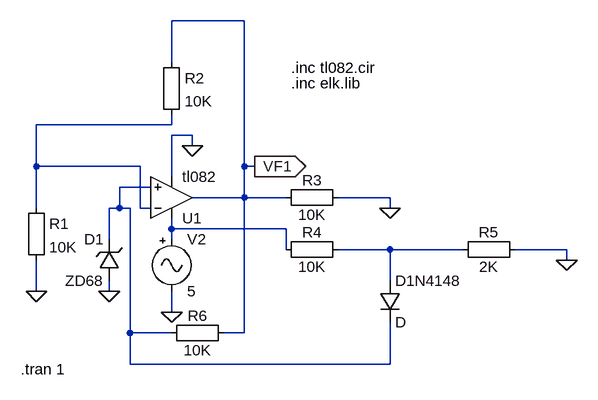
[diagram p0: schematic 10_2_TW_getauscht.asc]
10_2_TW_getauscht.asc, the LTspice schematic file:
Version 4
SHEET 1 1112 680
WIRE 240 -16 128 -16
WIRE 128 48 128 -16
WIRE 128 144 128 128
WIRE 128 144 -80 144
WIRE 160 160 128 160
WIRE 160 176 160 160
WIRE -80 208 -80 144
WIRE 80 208 -80 208
WIRE 240 208 240 -16
WIRE 256 208 240 208
WIRE 128 224 128 160
WIRE 96 240 48 240
WIRE 240 256 240 208
WIRE 240 256 160 256
WIRE 304 256 240 256
WIRE 464 256 384 256
WIRE -80 272 -80 208
WIRE 48 272 48 240
WIRE 48 272 32 272
WIRE 64 272 48 272
WIRE 80 272 80 208
WIRE 96 272 80 272
WIRE 464 272 464 256
WIRE 128 304 128 288
WIRE 304 304 128 304
WIRE 32 320 32 272
WIRE 128 320 128 304
WIRE 304 336 304 304
WIRE 464 336 384 336
WIRE 576 336 464 336
WIRE 736 336 656 336
WIRE 736 352 736 336
WIRE 464 384 464 336
WIRE -80 400 -80 352
WIRE 32 400 32 384
WIRE 128 432 128 400
WIRE 64 464 64 272
WIRE 128 464 64 464
WIRE 240 464 240 256
WIRE 240 464 208 464
WIRE 64 512 64 464
WIRE 464 512 464 448
WIRE 464 512 64 512
FLAG 128 432 0
FLAG -80 400 0
FLAG 160 176 0
FLAG 464 272 0
FLAG 736 352 0
FLAG 32 400 0
FLAG 256 208 VF1
IOPIN 256 208 Out
SYMBOL Misc\\EuropeanResistor -96 256 R0
SYMATTR InstName R1
SYMATTR Value 10K
SYMATTR SpiceLine tol=1 pwr=0.1
SYMBOL zener 48 384 R180
WINDOW 0 24 64 Left 2
WINDOW 3 24 0 Left 2
SYMATTR InstName D1
SYMATTR Value ZD68
SYMBOL Opamps\\opamp2 128 320 M180
SYMATTR InstName U1
SYMATTR Value tl082
SYMBOL Misc\\EuropeanResistor 112 32 R0
SYMATTR InstName R2
SYMATTR Value 10K
SYMATTR SpiceLine tol=1 pwr=0.1
SYMBOL Misc\\EuropeanResistor 400 240 R90
WINDOW 0 5 56 VBottom 2
WINDOW 3 27 56 VTop 2
SYMATTR InstName R3
SYMATTR Value 10K
SYMATTR SpiceLine tol=1 pwr=0.1
SYMBOL Misc\\EuropeanResistor 400 320 R90
WINDOW 0 5 56 VBottom 2
WINDOW 3 27 56 VTop 2
SYMATTR InstName R4
SYMATTR Value 10K
SYMATTR SpiceLine tol=1 pwr=0.1
SYMBOL Misc\\EuropeanResistor 672 320 R90
WINDOW 0 5 56 VBottom 2
WINDOW 3 27 56 VTop 2
SYMATTR InstName R5
SYMATTR Value 2K
SYMBOL diode 448 384 R0
SYMATTR InstName D1N4148
SYMBOL Misc\\EuropeanResistor 224 448 R90
WINDOW 0 5 56 VBottom 2
WINDOW 3 27 56 VTop 2
SYMATTR InstName R6
SYMATTR Value 10K
SYMATTR SpiceLine tol=1 pwr=0.1
SYMBOL Misc\\signal 128 304 R0
WINDOW 123 0 0 Left 0
WINDOW 39 0 0 Left 0
SYMATTR InstName V2
SYMATTR Value 5
TEXT 312 56 Left 2 !.inc tl082.cir
TEXT 312 80 Left 2 !.inc elk.lib
TEXT -104 520 Left 2 !.tran 1

The netlist it stands for:
* 10_2_TW_getauscht.asc
R1 N001 0 10K tol=1 pwr=0.1
D1 0 N002 ZD68
XU1 N002 N001 N003 0 VF1 tl082  ; pins In+ In- V+ V- OUT
R2 VF1 N001 10K tol=1 pwr=0.1
R3 0 VF1 10K tol=1 pwr=0.1
R4 N004 N003 10K tol=1 pwr=0.1
R5 0 N004 2K
D1N4148 N004 N002 D
R6 VF1 N002 10K tol=1 pwr=0.1
V2 N003 0 5
.model D D
.lib standard.dio
.inc tl082.cir
.inc elk.lib
.tran 1
.backanno
.end